# EAGLE design force_sensor_pcb_v1 (EAGLE 9.1.3)
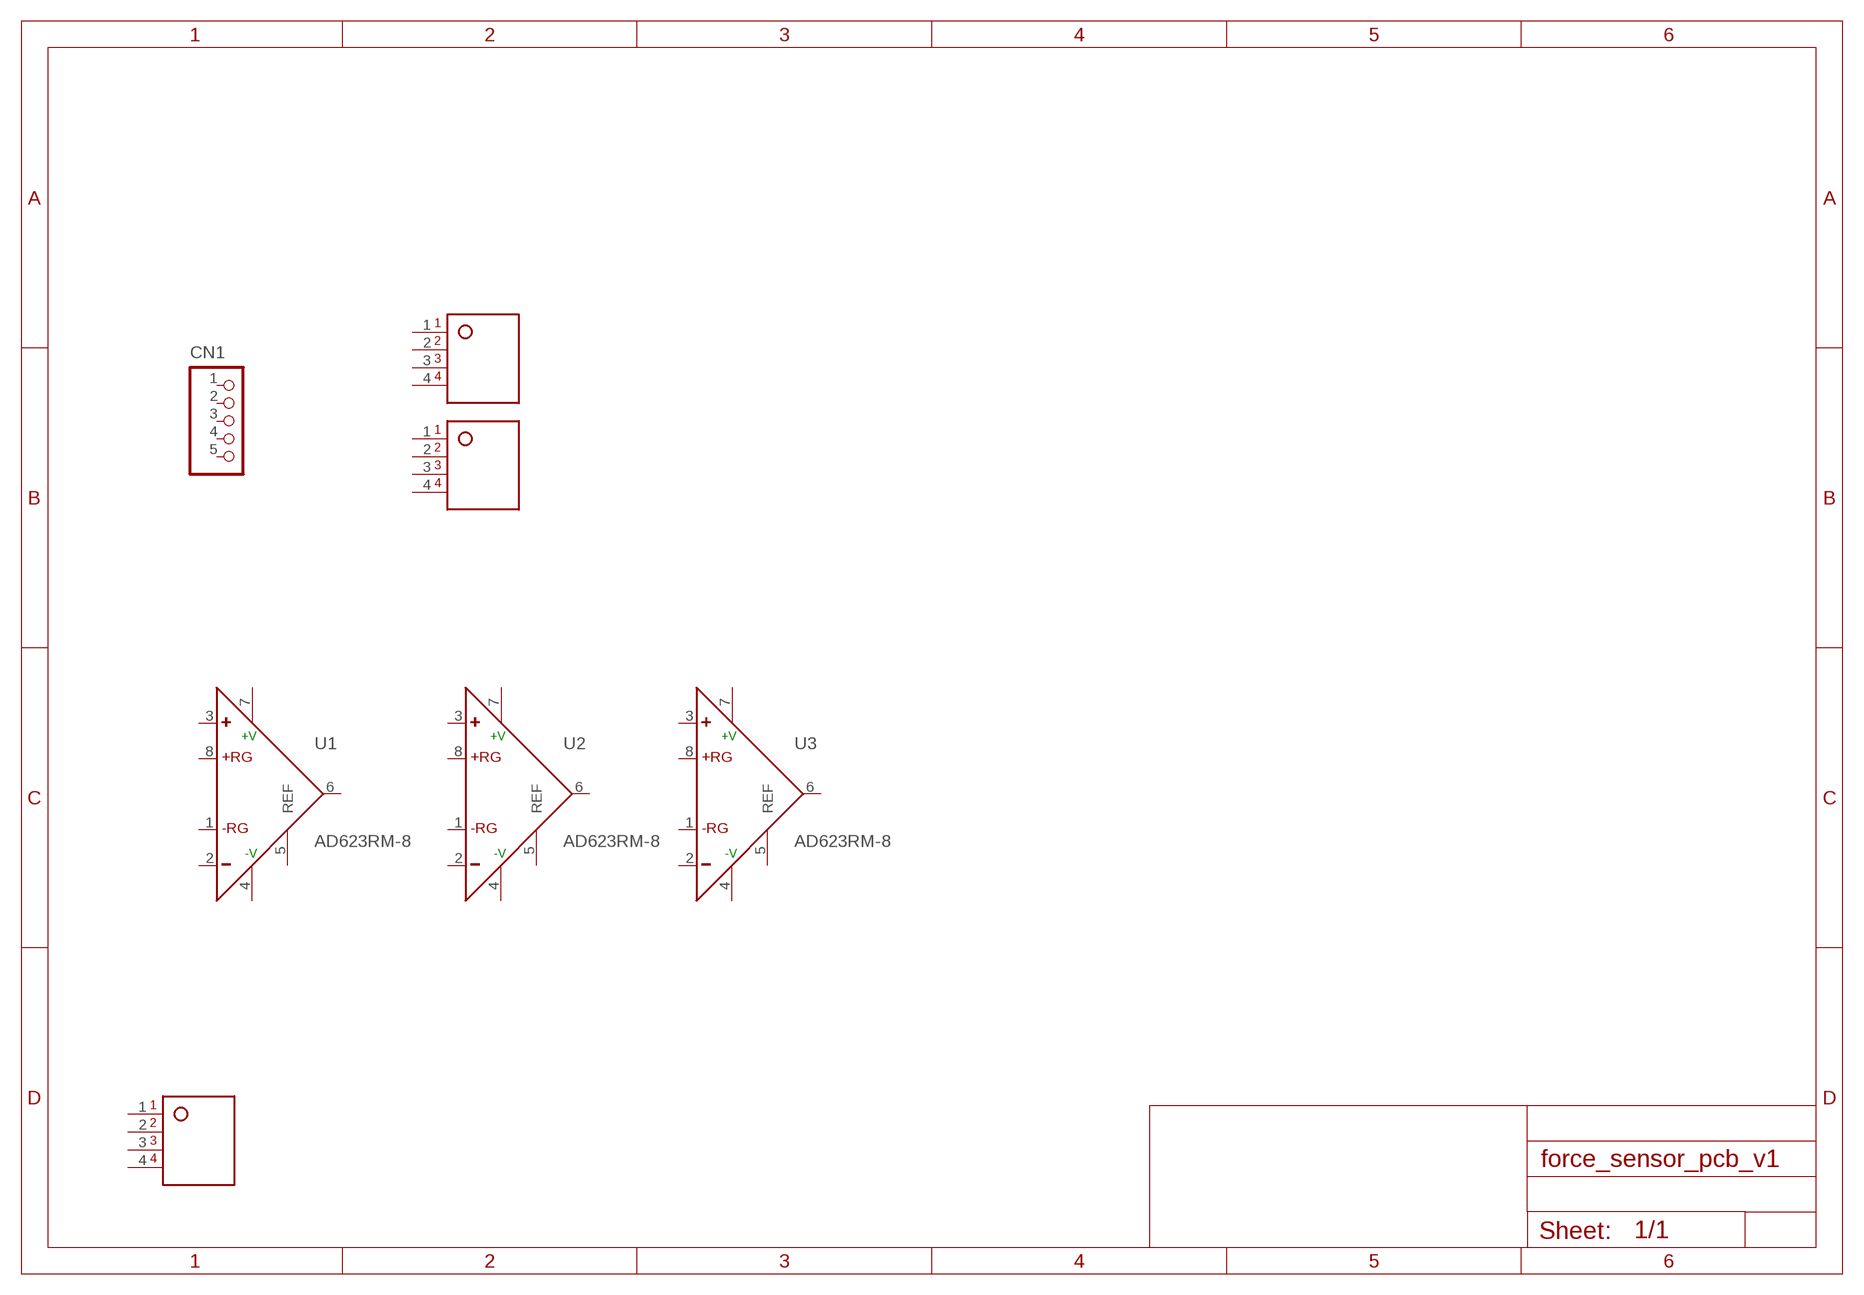
[diagram p0: schematic, sheet 1]

## Parts
CN1  B5B-PH-K-S  [B5B-PH-K-S]
U1  AD623RM-8  [MSOP08]
U2  AD623RM-8  [MSOP08]
U3  AD623RM-8  [MSOP08]
U$1  KYOCERA-62774P  [KYOCERA-6277-4]
U$5  DF58-4P4P  [DF58-4P]
U$6  DF58-4P4P  [DF58-4P]
Unconnected: CN1.1 CN1.2 CN1.3 CN1.4 CN1.5 U1.1(-RG) U1.2(-IN) U1.3(+IN) U1.5(REF) U1.6(OUT) U1.8(+RG) U2.1(-RG) U2.2(-IN) U2.3(+IN) U2.5(REF) U2.6(OUT) U2.8(+RG) U3.1(-RG) U3.2(-IN) U3.3(+IN) U3.5(REF) U3.6(OUT) U3.8(+RG) U$1.1 U$1.2 U$1.3 U$1.4 U$5.1 U$5.2 U$5.3 U$5.4 U$6.1 U$6.2 U$6.3 U$6.4

## Power pins joined to a net without a drawn wire
+V: U1.7(+V) U2.7(+V) U3.7(+V)
-V: U1.4(-V) U2.4(-V) U3.4(-V)

## Library data of the parts
CN1 = jst-ph:B5B-PH-*: Wire-to-Board 2.0mm pitch top mount connector Source: http://www.jst-mfg.com/product/pdf/jpn/PH.pdf http://www.jst-mfg.com/product/detail.php?series=199
U1-U3 = yunit-tech_eagle_library:AD623
U$1 = yunit-tech_eagle_library:KYOCERA-6277: 0.5mmピッチ RA STM 両面接点 ワンタッチロック
U$5 U$6 = yunit-tech_eagle_library:DF58-4P

## Board
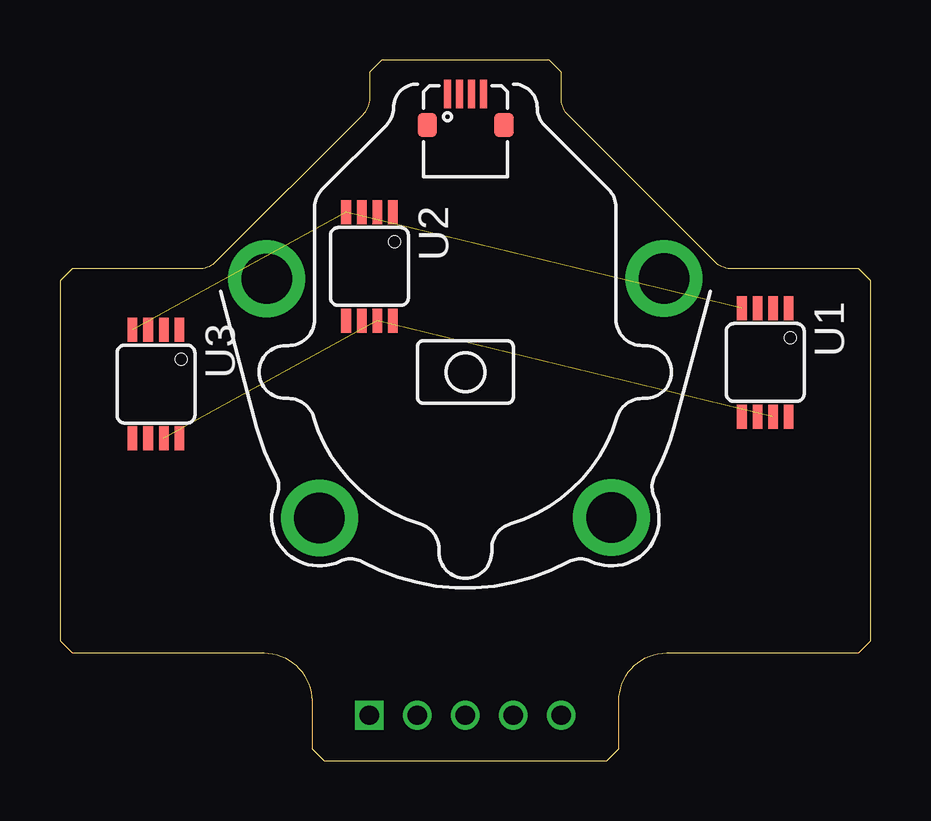
[diagram p1: board, top side]
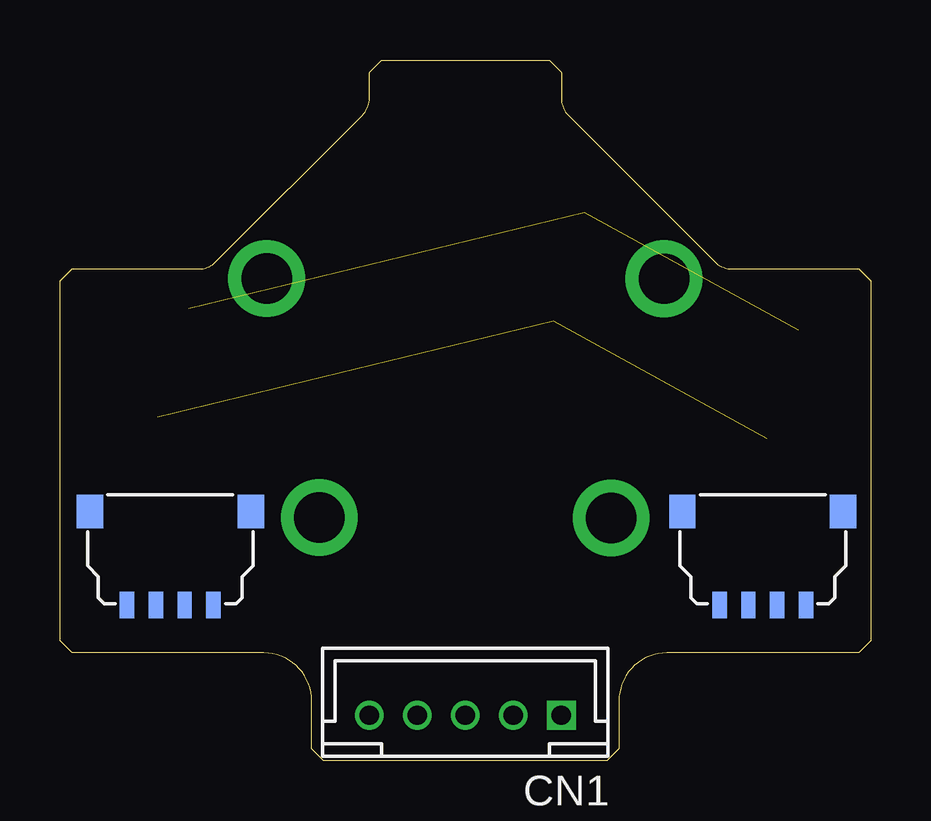
[diagram p2: board, bottom side, seen from below]

Size 33.8 x 29.2 mm. Coordinates in mm from the lower left corner, seen from the top.
Outline: 28.01,20.5 arc-45 27.3,20.79 21.19,26.9 arc-45 20.9,27.61 20.9,28.7 20.4,29.2 13.4,29.2 12.9,28.7 12.9,27.61 arc-45 12.61,26.9 6.5,20.79 arc-45 5.79,20.5 0.5,20.5 0,20 0,5 0.5,4.5 8.5,4.5 arc-90 10.5,2.5 10.5,0.5 11,0 22.8,0 23.3,0.5 23.3,2.5 arc-90 25.3,4.5 33.3,4.5 33.8,5 33.8,20 33.3,20.5 28.01,20.5
Copper layers (1*16): Top 0.035mm / dielectric 1.6mm / Bottom 0.035mm
Design rules "Elecrow_2-layer_PCB_eagle_rule": minimum track width 6mil, minimum drill 12mil, track to track 7mil, track to pad 7mil, pad to pad 7mil, via to via 8mil, smd to smd 0mil, copper to edge 20mil, drill to drill 10mil, minimum pad ring 6mil, minimum via ring 6mil, stop-mask expansion 0mil, vias tented up to drill 100mil, thermal gap 10mil

### Footprints (pad centres in the part's own frame; a part is rotated, then mirrored left to right if it is on the bottom)
B5B-PH-K-S = drill 0.8 square: 1 -4,0 | drill 0.8: 2 -2,0; 3 0,0; 4 2,0; 5 4,0
MSOP08 = smd 0.4 x 1: 1 -0.976,-2.263; 2 -0.326,-2.263; 3 0.324,-2.263; 4 0.974,-2.263; 5 0.974,2.262; 6 0.324,2.262; 7 -0.326,2.262; 8 -0.976,2.262
KYOCERA-6277-4 = smd 0.3 x 1.2: 1 -0.75,1.3; 2 -0.25,1.3; 3 0.25,1.3; 4 0.75,1.3 | smd 0.8 x 1: PAD-1 -1.6,0; PAD-2 1.6,0
DF58-4P = smd 0.6 x 1.1: 1 -1.8,4.6; 2 -0.6,4.6; 3 0.6,4.6; 4 1.8,4.6 | smd 1.1 x 1.4: PAD1 -3.35,0.7; PAD2 3.35,0.7

### Placement (x,y rotation side)
CN1  16.9,1.9 180 bottom
U1  29.4,16.6 180 top
U2  12.9,20.6 180 top
U3  4,15.7 180 top
U$1  16.91,26.49 0 top
U$5  4.5,11.1 180 bottom
U$6  29.2,11.1 180 bottom

### Tracks (layer width: path | path; a pad name or v marks a point on that pad's centre or on a via)
+V  (2 unrouted)
-V  (2 unrouted)
N$1  (via drill 2.1 pad 3.2)
  other vias: 8.62,20.09
N$2  (via drill 2.1 pad 3.2)
  other vias: 25.18,20.1
N$3  (via drill 2.1 pad 3.2)
  other vias: 22.99,10.14
N$4  (via drill 2.1 pad 3.2)
  other vias: 10.82,10.12